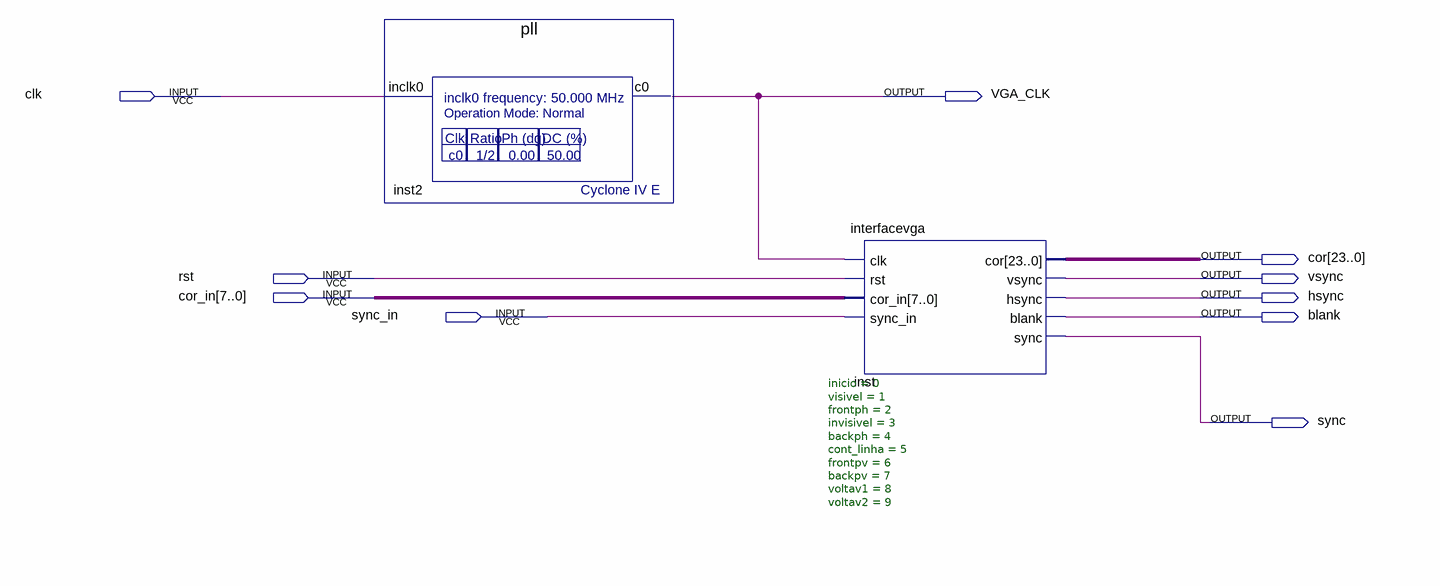
[diagram p0: schematic sheet]
// Quartus schematic interface_vga.bdf as structural Verilog: 2 symbols, 10 pins
module interface_vga (
  input  clk,
  input  rst,
  input  [7:0] cor_in,
  input  sync_in,
  output VGA_CLK,
  output [23:0] cor,
  output vsync,
  output hsync,
  output blank,
  output sync
);

  pll inst2 (.inclk0(clk), .c0(VGA_CLK));
  interfacevga #(.inicio(0), .visivel(1), .frontph(2), .invisivel(3), .backph(4), .cont_linha(5), .frontpv(6), .backpv(7), .voltav1(8), .voltav2(9)) inst (
    .clk(VGA_CLK), .rst(rst), .cor_in(cor_in), .sync_in(sync_in), .cor(cor), .vsync(vsync), .hsync(hsync),
    .blank(blank), .sync(sync));
endmodule
